# EAGLE schematic led_display_v1.0 (EAGLE 6.1)
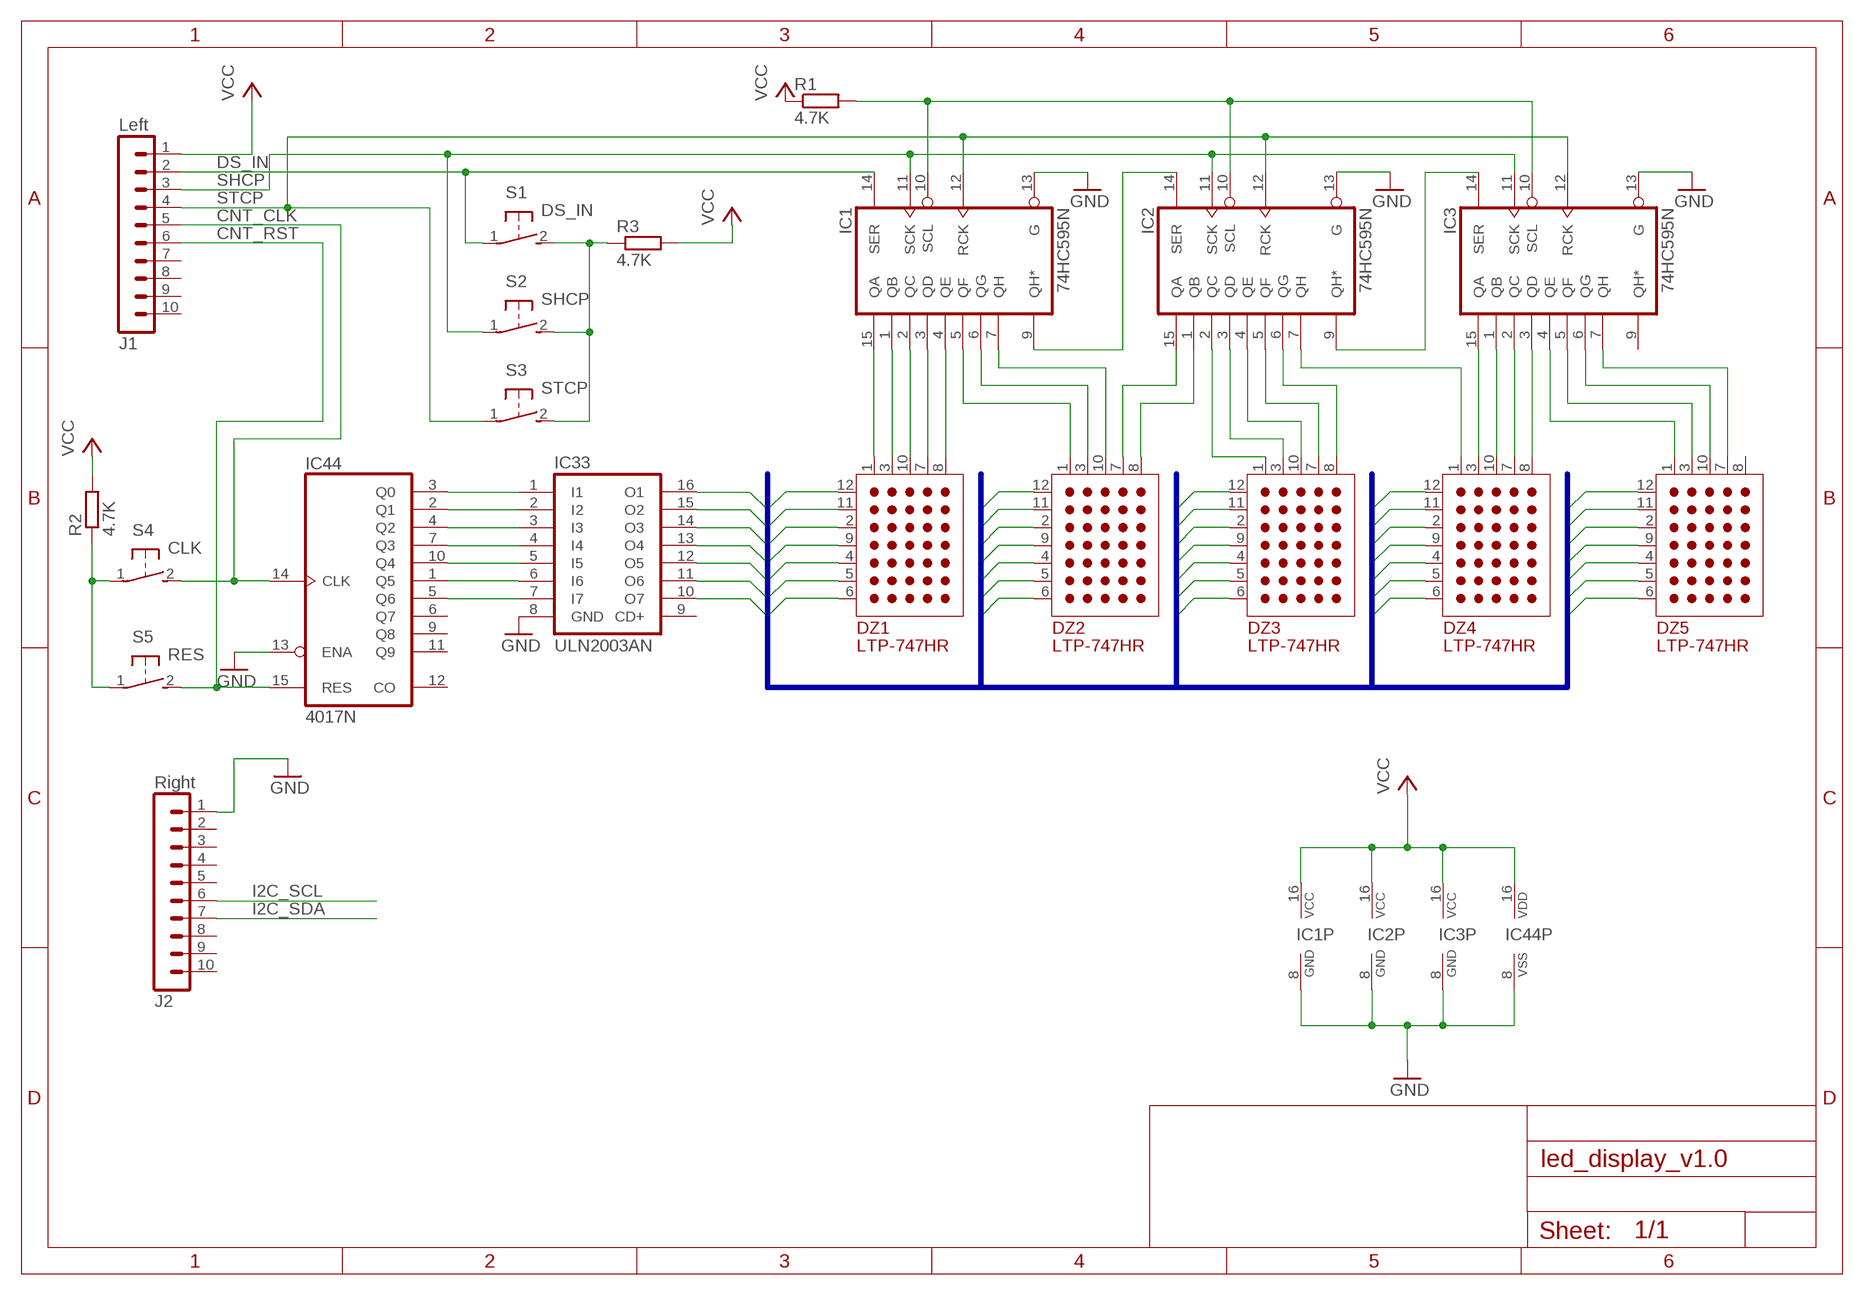
[diagram p0: schematic, sheet 1]

## Parts
DZ1  LTP-747HR  [LTP-747HR]
DZ2  LTP-747HR  [LTP-747HR]
DZ3  LTP-747HR  [LTP-747HR]
DZ4  LTP-747HR  [LTP-747HR]
DZ5  LTP-747HR  [LTP-747HR]
IC1  74HC595N  [DIL16]
IC2  74HC595N  [DIL16]
IC3  74HC595N  [DIL16]
IC33  ULN2003AN  [DIL16]
IC44  4017N  [DIL16]
J1  Left  MA10-1  [MA10-1]
J2  Right  MA10-1  [MA10-1]
R1  4.7K  R-EU_0204/2V  [0204V]
R2  4.7K  R-EU_0204/2V  [0204V]
R3  4.7K  R-EU_0204/2V  [0204V]
S1  DS_IN  31-XX  [B3F-31XX]
S2  SHCP  31-XX  [B3F-31XX]
S3  STCP  31-XX  [B3F-31XX]
S4  CLK  31-XX  [B3F-31XX]
S5  RES  31-XX  [B3F-31XX]

## Nets
CNT_CLK: IC44.14(CLK) J1.5 S4.2(S)
CNT_RST: IC44.15(RES) J1.6 S5.2(S)
DS_IN: IC1.14(SER) J1.2 S1.1(P)
GND: IC1.8(GND) IC1.13(G) IC2.8(GND) IC2.13(G) IC3.8(GND) IC3.13(G) IC33.8(GND) IC44.8(VSS) IC44.13(ENA) J2.1
I2C_SCL: J2.6
I2C_SDA: J2.7
N$1: IC1.9(QH*) IC2.14(SER)
N$2: IC2.9(QH*) IC3.14(SER)
N$3: IC33.1(I1) IC44.3(Q0)
N$4: IC33.2(I2) IC44.2(Q1)
N$5: IC1.10(SCL) IC2.10(SCL) IC3.10(SCL) R1.2
N$6: DZ3.8(C5) IC2.6(QG)
N$7: DZ1.1(C1) IC1.15(QA)
N$8: DZ1.3(C2) IC1.1(QB)
N$9: DZ1.10(C3) IC1.2(QC)
N$10: DZ1.7(C4) IC1.3(QD)
N$11: DZ1.8(C5) IC1.4(QE)
N$12: DZ2.1(C1) IC1.5(QF)
N$13: DZ2.3(C2) IC1.6(QG)
N$14: DZ2.10(C3) IC1.7(QH)
N$15: DZ2.7(C4) IC2.15(QA)
N$16: DZ2.8(C5) IC2.1(QB)
N$17: DZ3.1(C1) IC2.2(QC)
N$18: DZ3.3(C2) IC2.3(QD)
N$19: DZ3.10(C3) IC2.4(QE)
N$20: DZ3.7(C4) IC2.5(QF)
N$21: DZ4.1(C1) IC2.7(QH)
N$22: DZ4.3(C2) IC3.15(QA)
N$23: DZ4.10(C3) IC3.1(QB)
N$24: DZ4.7(C4) IC3.2(QC)
N$25: DZ4.8(C5) IC3.3(QD)
N$26: DZ5.1(C1) IC3.4(QE)
N$27: DZ5.3(C2) IC3.5(QF)
N$28: DZ5.10(C3) IC3.6(QG)
N$29: DZ5.7(C4) IC3.7(QH)
N$30: IC33.3(I3) IC44.4(Q2)
N$31: IC33.4(I4) IC44.7(Q3)
N$32: IC33.5(I5) IC44.10(Q4)
N$33: IC33.6(I6) IC44.1(Q5)
N$34: IC33.7(I7) IC44.5(Q6)
N$35: R2.1 S4.1(P) S5.1(P)
N$36: R3.1 S1.2(S) S2.2(S) S3.2(S)
R1: DZ1.12(R1) DZ2.12(R1) DZ3.12(R1) DZ4.12(R1) DZ5.12(R1) IC33.16(O1)
R2: DZ1.11(R2) DZ2.11(R2) DZ3.11(R2) DZ4.11(R2) DZ5.11(R2) IC33.15(O2)
R3: DZ1.2(R3) DZ2.2(R3) DZ3.2(R3) DZ4.2(R3) DZ5.2(R3) IC33.14(O3)
R4: DZ1.9(R4) DZ2.9(R4) DZ3.9(R4) DZ4.9(R4) DZ5.9(R4) IC33.13(O4)
R5: DZ1.4(R5) DZ2.4(R5) DZ3.4(R5) DZ4.4(R5) DZ5.4(R5) IC33.12(O5)
R6: DZ1.5(R6) DZ2.5(R6) DZ3.5(R6) DZ4.5(R6) DZ5.5(R6) IC33.11(O6)
R7: DZ1.6(R7) DZ2.6(R7) DZ3.6(R7) DZ4.6(R7) DZ5.6(R7) IC33.10(O7)
SHCP: IC1.11(SCK) IC2.11(SCK) IC3.11(SCK) J1.3 S2.1(P)
STCP: IC1.12(RCK) IC2.12(RCK) IC3.12(RCK) J1.4 S3.1(P)
VCC: IC1.16(VCC) IC2.16(VCC) IC3.16(VCC) IC44.16(VDD) J1.1 R1.1 R2.2 R3.2
Unconnected: DZ5.8(C5) IC3.9(QH*) IC33.9(CD+) IC44.6(Q7) IC44.9(Q8) IC44.11(Q9) IC44.12(CO) J1.7 J1.8 J1.9 J1.10 J2.2 J2.3 J2.4 J2.5 J2.8 J2.9 J2.10

## Buses
R[1..7]

## Library data of the parts
DZ1-DZ5 = ledmatrix:LTP-747HR: 5x7 Dot Matrix LED Display
IC1-IC3 = 74xx-eu:74*595: 8-bit SHIFT REGISTER, output latch
IC33 = uln-udn:ULN2003A: DRIVER ARRAY
IC44 = 40xx:4017: COUNTER/DIVIDER
J1 J2 = con-lstb:MA10-1: PIN HEADER; OC_FARNELL: unknown; OC_NEWARK: unknown
R1-R3 = resistor:R-EU_: RESISTOR, European symbol
S1-S5 = switch-omron:31-XX: OMRON SWITCH; MPN: B3F-3100; OC_FARNELL: 959704; OC_NEWARK: 36M3582